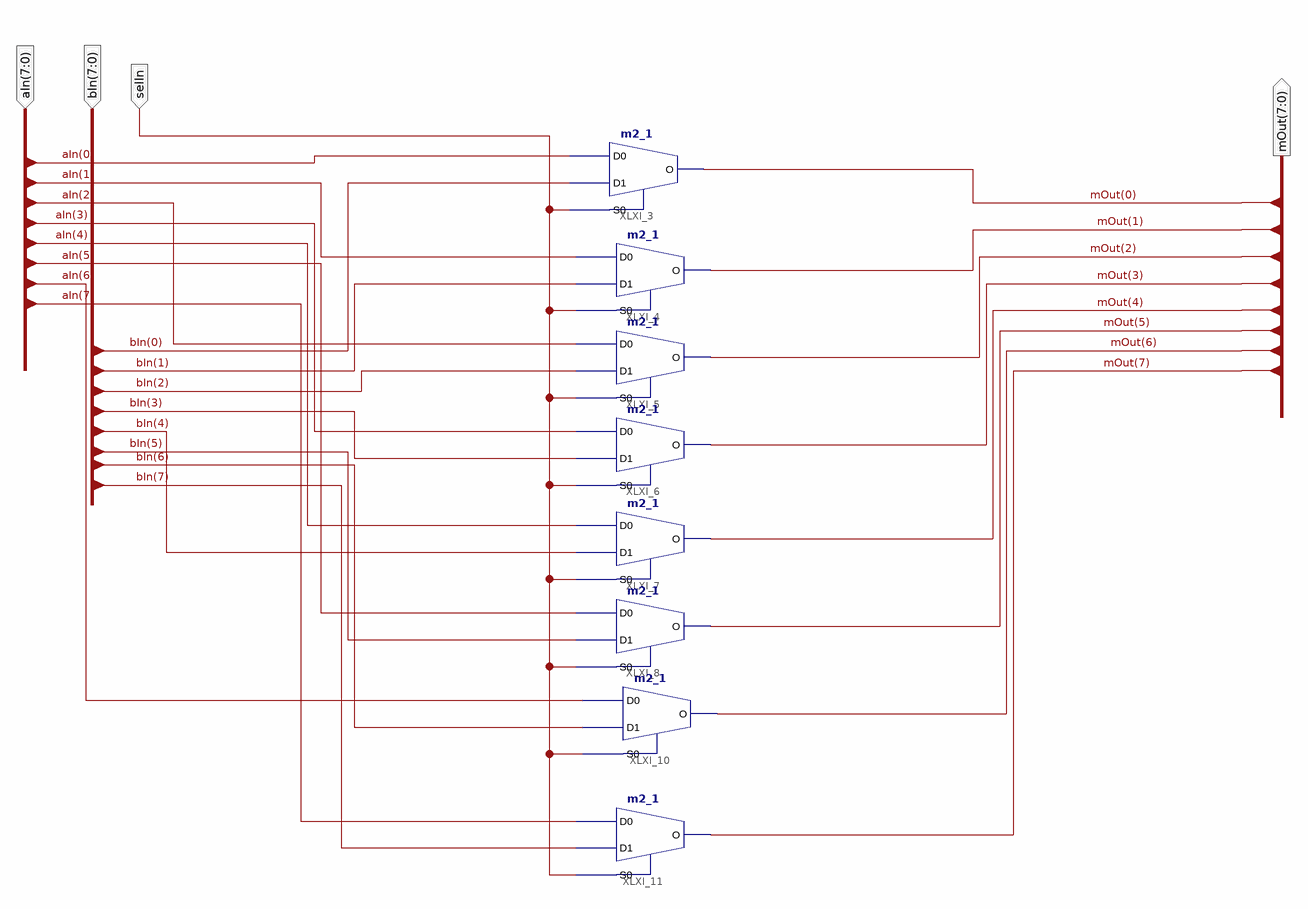
[diagram p0: schematic sheet 1]
// Xilinx ISE schematic eightBitMux.sch (spartan3e) as structural Verilog: 8 symbols, 4 ports
module eightBitMux (
  input  [7:0] aIn,
  input  [7:0] bIn,
  input  selIn,
  output [7:0] mOut
);

  m2_1 XLXI_3 (.D0(aIn[0]), .D1(bIn[0]), .S0(selIn), .O(mOut[0]));
  m2_1 XLXI_4 (.D0(aIn[1]), .D1(bIn[1]), .S0(selIn), .O(mOut[1]));
  m2_1 XLXI_5 (.D0(aIn[2]), .D1(bIn[2]), .S0(selIn), .O(mOut[2]));
  m2_1 XLXI_6 (.D0(aIn[3]), .D1(bIn[3]), .S0(selIn), .O(mOut[3]));
  m2_1 XLXI_7 (.D0(aIn[4]), .D1(bIn[4]), .S0(selIn), .O(mOut[4]));
  m2_1 XLXI_8 (.D0(aIn[5]), .D1(bIn[5]), .S0(selIn), .O(mOut[5]));
  m2_1 XLXI_10 (.D0(aIn[6]), .D1(bIn[6]), .S0(selIn), .O(mOut[6]));
  m2_1 XLXI_11 (.D0(aIn[7]), .D1(bIn[7]), .S0(selIn), .O(mOut[7]));
endmodule
